# EasyEDA schematic UAS SENSOR.json
TITLE: Sheet_1; REV: 1.0; Date: 2025-12-12; Sheet: 1/1; Drawn By: yasirahmadin; Company: Your Company
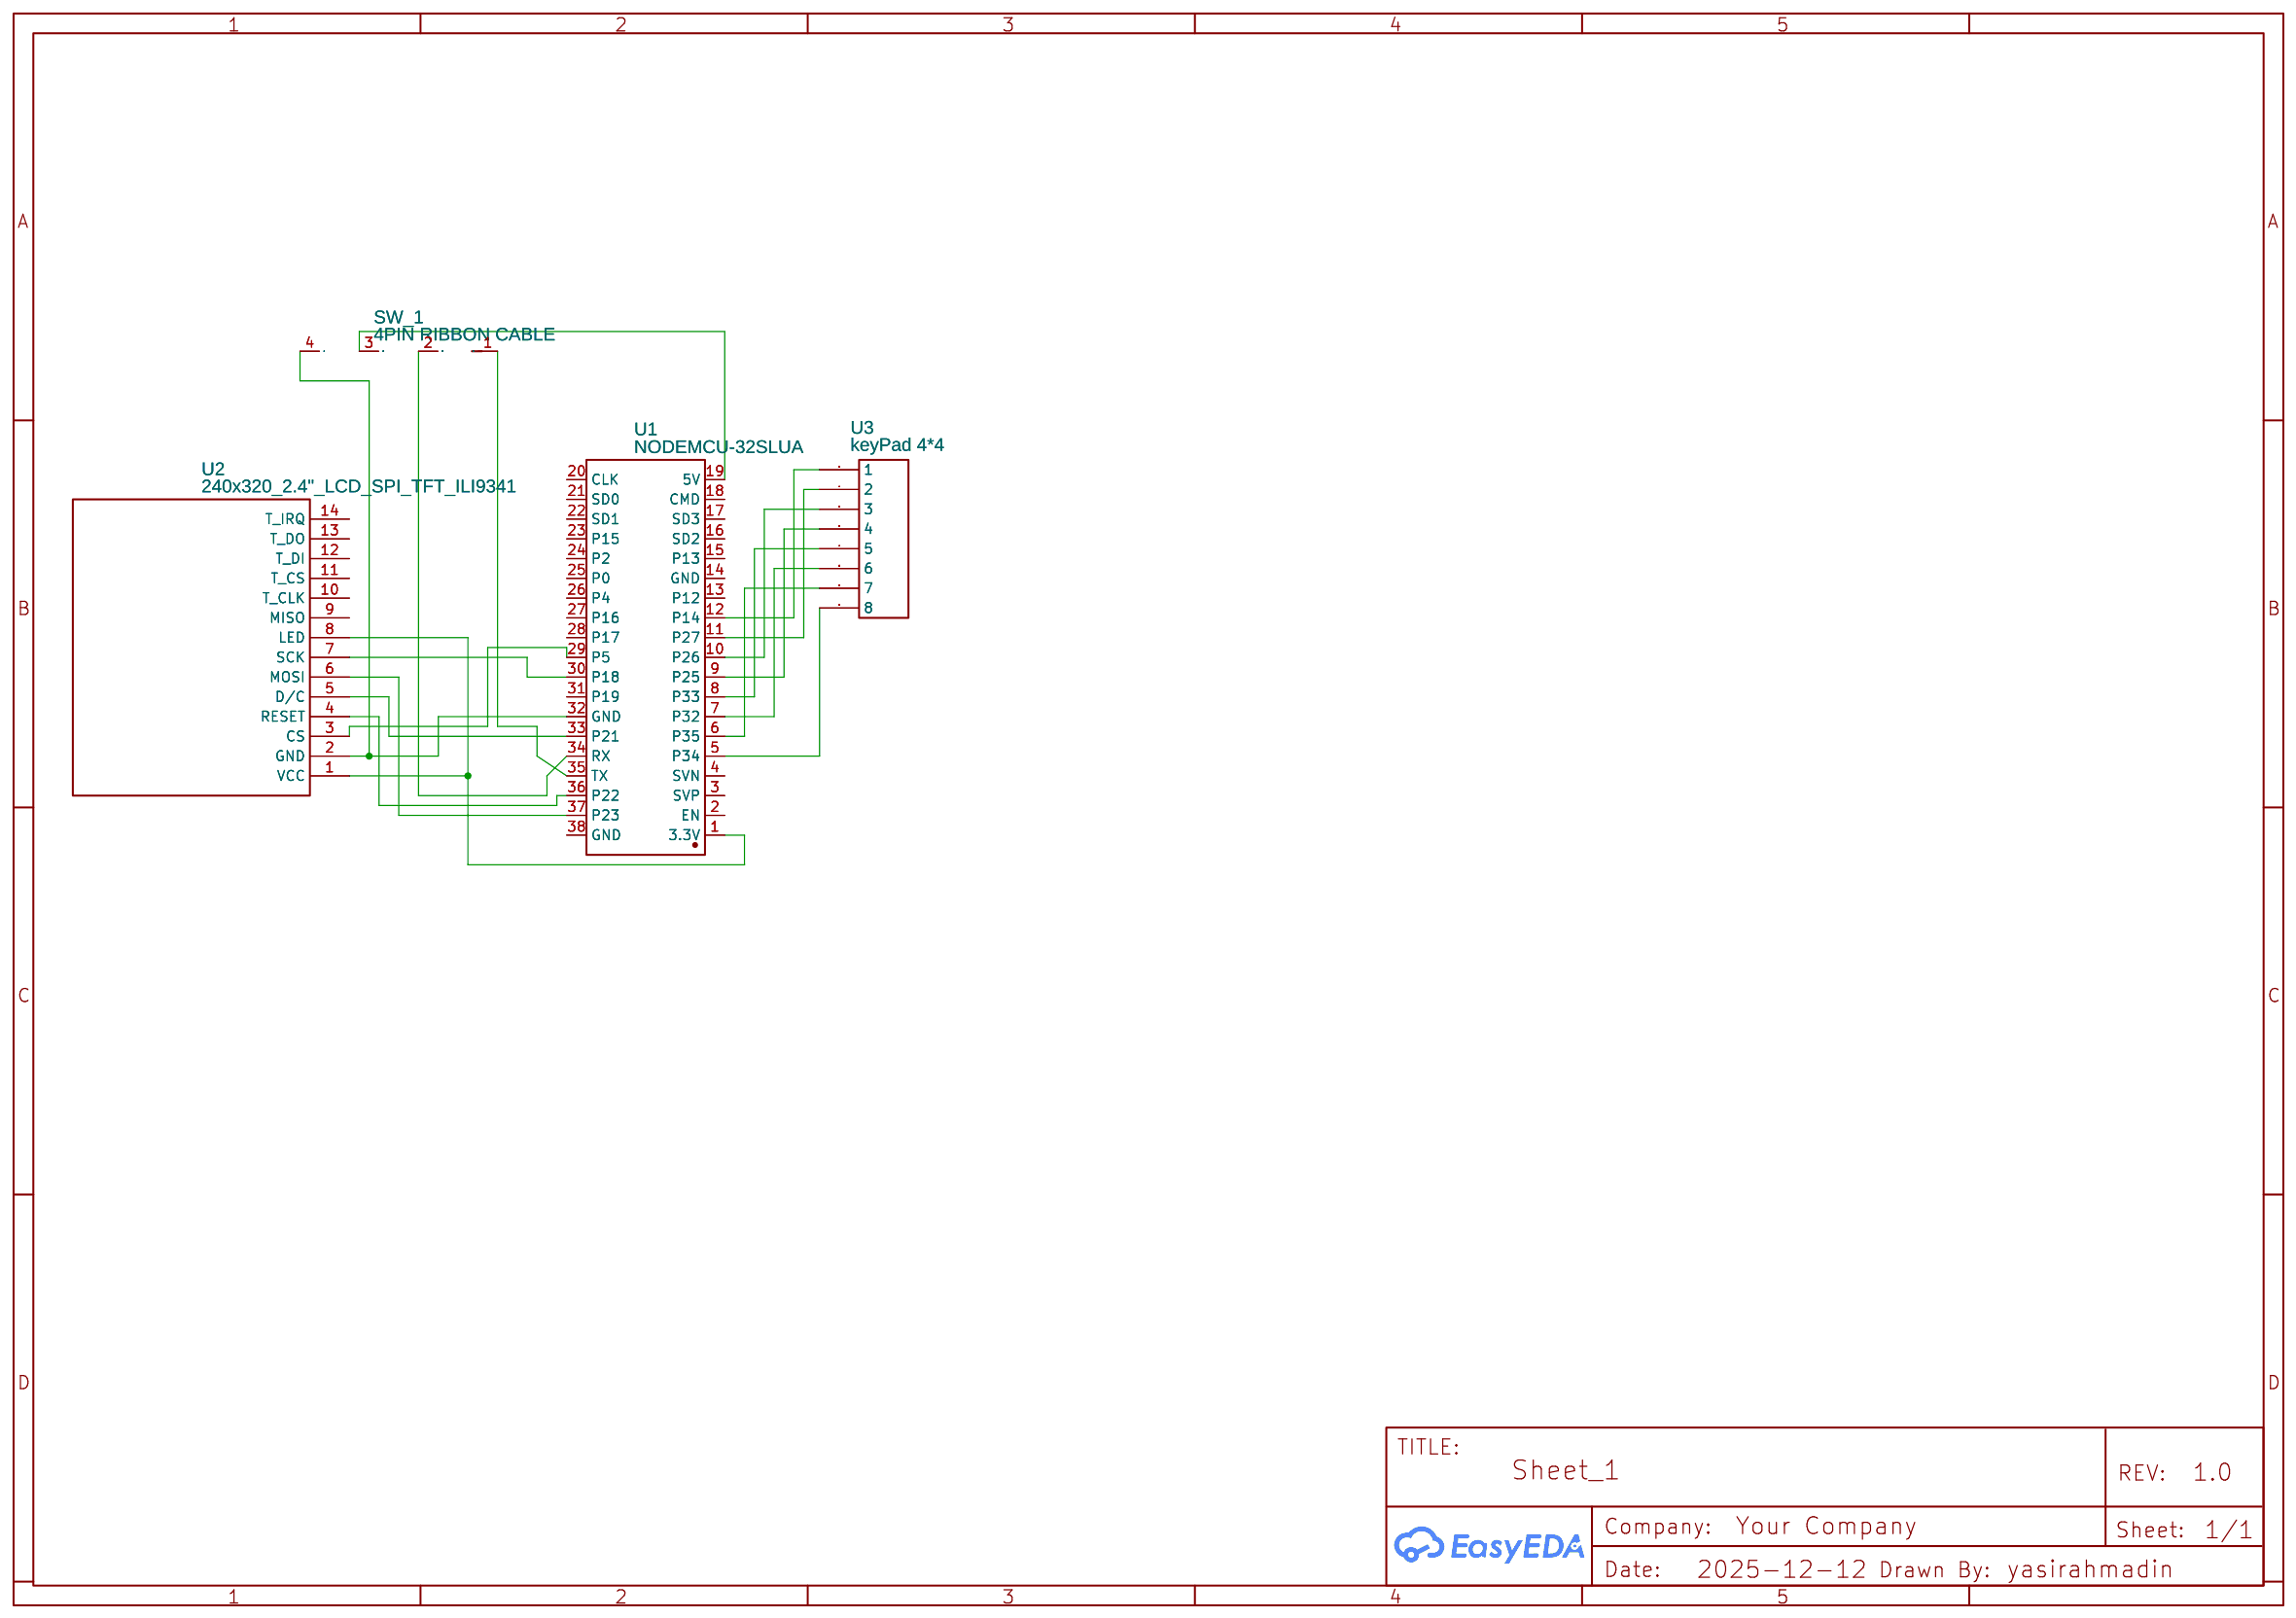
[diagram p0: schematic sheet]

## Parts
SW_1  4PIN RIBBON CABLE  [4PIN RIBBON]
U1  NODEMCU-32SLUA  [COMM-TH_NODEMCU-32SLUA]
U2  240x320_2.4"_LCD_SPI_TFT_ILI9341  [2.4_TFT_TS]
U3  keyPad 4*4  [KEYPAD 4X4 (KEYPAD 4*4)]

## Library data of the parts
SW_1 = 4PIN RIBBON CABLE: Contributor: Fontelroy
U1 = NODEMCU-32SLUA: Contributor: lcsc; Supplier: LCSC; Supplier Part: C111436; Manufacturer: Ai-Thinker(安信可); Manufacturer Part: NodeMCU-32SLua; JLCPCB Part Class: Extended Part
U2 = 240x320_2.4"_LCD_SPI_TFT_ILI9341: link: https://m.fr.aliexpress.com/item/1005003943508410.html?spm=a2g0n.productlist.0.0.2027LzWdLzWd8D&browser_id=ecfaa73479da4068b88a8c3c087051d2&aff_trace_key=&aff_platform=msite&m_page_id=r6f7f2wlkfgcavlr182cb15a1261bbbc5cc0b1321f&gclid=&pdp_npi=2%40dis%21EUR%215.64%215.64%21%21%211.92%21%21%402100bdd516612645687807622e98aa%2112000027524871519%21sea&curPageLogUid=FFVU9dVV5pTm&algo_pvid=f8147638-b09c-4154-9cfe-566d466187ae; Contributor: AtifIqbal
U3 = keyPad 4*4: Contributor: seif527

## Nets
Net-(SW_1-1): SW_1.1 U1.35(TX)
Net-(SW_1-2): SW_1.2 U1.34(RX)
Net-(SW_1-3): SW_1.3 U1.19(5V)
Net-(SW_1-4): SW_1.4 U1.32(GND) U2.2(GND)
Net-(U1-1): U1.1(3.3V) U2.1(VCC) U2.8(LED)
Net-(U1-5): U1.5(P34) U3.10(8)
Net-(U1-6): U1.6(P35) U3.9(7)
Net-(U1-7): U1.7(P32) U3.8(6)
Net-(U1-8): U1.8(P33) U3.7(5)
Net-(U1-9): U1.9(P25) U3.6(4)
Net-(U1-10): U1.10(P26) U3.5(3)
Net-(U1-11): U1.11(P27) U3.4(2)
Net-(U1-12): U1.12(P14) U3.3(1)
Net-(U1-29): U1.29(P5) U2.3(CS)
Net-(U1-30): U1.30(P18) U2.7(SCK)
Net-(U1-33): U1.33(P21) U2.5(D/C)
Net-(U1-36): U1.36(P22) U2.4(RESET)
Net-(U1-37): U1.37(P23) U2.6(MOSI)

Not connected (* = marked no-connect by the designer): U1 2(EN) 3(SVP) 4(SVN) 13(P12) 14(GND) 15(P13) 16(SD2) 17(SD3) 18(CMD) 20(CLK) 21(SD0) 22(SD1) 23(P15) 24(P2) 25(P0) 26(P4) 27(P16) 28(P17) 31(P19) 38(GND); U2 9(MISO) 10(T_CLK) 11(T_CS) 12(T_DI) 13(T_DO) 14(T_IRQ)
